# EAGLE design lt3652-pre-v03 (EAGLE 5.10)
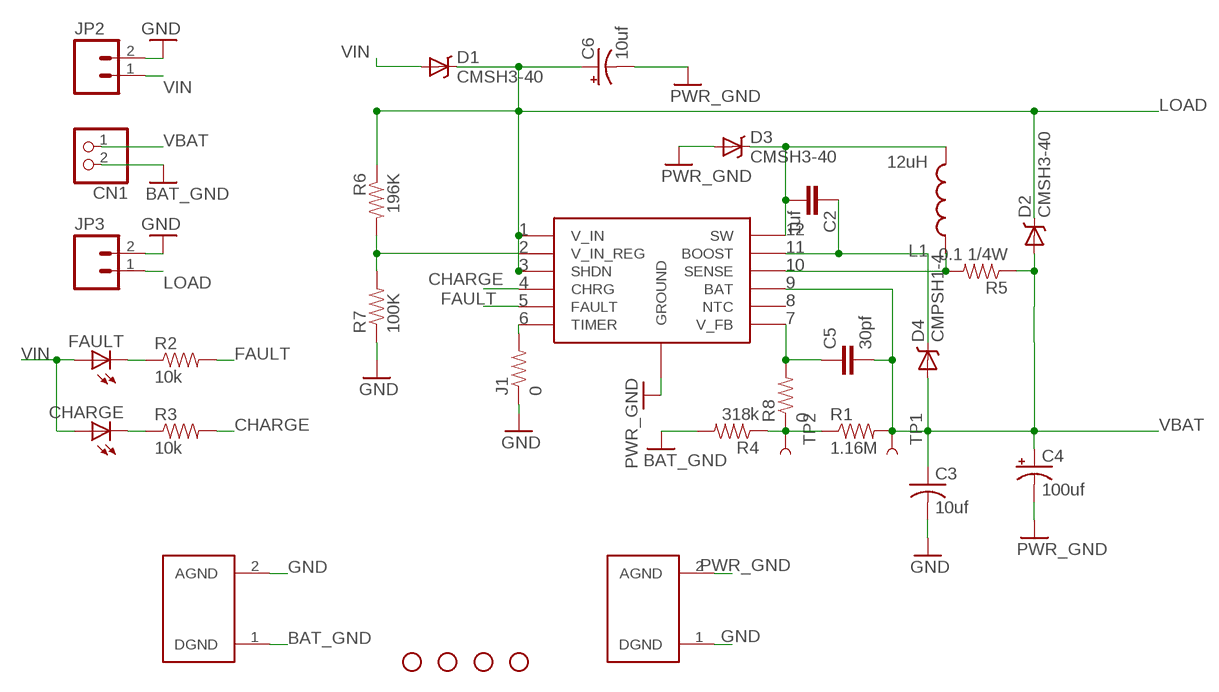
[diagram p0: schematic, sheet 1]

## Parts
C2  1uf  CAP0805  [0805]
C3  10uf  C-USC1210  [C1210]
C4  100uf  CAP_POL7343  [EIA7343]
C5  30pf  CAP0805  [0805]
C6  10uf  CAP_POLE  [PANASONIC_E]
CHARGE  LED0603  [LED-0603]
CN1  JST_2PIN-SMT-RA  [JST-PH-2-SMT-RA]
D1  CMSH3-40  [CMSH3-40]
D2  CMSH3-40  [CMSH3-40]
D3  CMSH3-40  [CMSH3-40]
D4  CMPSH1-4  [CMPSH1-4]
FAULT  LED0603  [LED-0603]
J1  0  RESISTOR  [0805]
JP1  STAND-OFF  [STAND-OFF]
JP2  M023.5MM  [SCREWTERMINAL-3.5MM-2]
JP3  M023.5MM  [SCREWTERMINAL-3.5MM-2]
JP4  STAND-OFF  [STAND-OFF]
JP5  STAND-OFF  [STAND-OFF]
JP6  STAND-OFF  [STAND-OFF]
L1  12uH  PANASONIC_ELLCTV  [PANASONIC_ELLCTV]
R1  1.16M  RESISTOR0603-RES  [0603-RES]
R2  10k  RESISTOR0603-RES  [0603-RES]
R3  10k  RESISTOR0603-RES  [0603-RES]
R4  318k  RESISTOR0603-RES  [0603-RES]
R5  0.1 1/4W  RESISTOR1206  [1206]
R6  196K  RESISTOR0603-RES  [0603-RES]
R7  100K  RESISTOR0603-RES  [0603-RES]
R8  0  RESISTOR0603-RES  [0603-RES]
TP1  TEST-POINT3X5  [PAD.03X.05]
TP2  TEST-POINT3X5  [PAD.03X.05]
U$1  LTC3652_MSOP  [MSOP12]
U$2  AGND_GND  [GND_CONNECT]
U$3  AGND_GND  [GND_CONNECT]

## Nets
BAT_GND: CN1.2 R4.2 U$2.1(DGND)
CHARGE: R3.2 U$1.4(CHRG)
FAULT: R2.2 U$1.5(FAULT)
GND: J1.1 JP2.2 JP3.2 R7.1 U$2.2(AGND) U$3.1(DGND)
LOAD: C6.+ D1.2(C) D2.2(C) JP3.1 R6.1 U$1.1(V_IN) U$1.3(SHDN)
N$1: C5.1 R8.2 U$1.7(V_FB)
N$2: R1.1 R4.1 R8.1 TP2.P$1
N$3: C2.1 D4.3(C) U$1.11(BOOST)
N$4: CHARGE.C R3.1
N$5: FAULT.C R2.1
N$6: L1.1 R5.2 U$1.10(SENSE)
N$13: C2.2 D3.2(C) L1.2 U$1.12(SW)
N$17: J1.2 U$1.6(TIMER)
N$18: R6.2 R7.2 U$1.2(V_IN_REG)
PWR_GND: C3.2 C4.C(-) C6.- D3.1(A) U$1.GND(GROUND) U$3.2(AGND) ; supply symbol labelled GND
VBAT: C3.1 C4.A(+) C5.2 CN1.1 D2.1(A) D4.1(A) R1.2 R5.1 TP1.P$1 U$1.9(BAT)
VIN: CHARGE.A D1.1(A) FAULT.A JP2.1
Unconnected: U$1.8(NTC)

## Library data of the parts
C2 C5 = SparkFun:CAP: Capacitor Standard 0603 ceramic capacitor, and 0.1" leaded capacitor.
C3 = adafruit:C-US: CAPACITOR, American symbol
C4 C6 = SparkFun:CAP_POL: Capacitor Polarized These are standard SMD and PTH capacitors. Normally 10uF, 47uF, and 100uF in electrolytic and tantalum varieties. Always verify the external diameter of the through hole cap, it varies with capacity, voltage, and manufacturer. The EIA devices should be standard.
CHARGE FAULT = SparkFun:LED: LEDs Standard schematic elements and footprints for 5mm, 3mm, 1206, and 0603 sized LEDs. 5mm - Spark Fun Electronics SKU : COM-00529 (and others)
CN1 = adafruit:JST_2PIN: JST 2-Pin Connectors of various flavors SMT-RA (S2B-PH-SM4) 4UConnector #17311 SMT (B2B-PH-SM4) THM-RA (S2B-PH) THM (B2B-PH)
D1-D3 = ssozonoff:CMSH3-40
D4 = ssozonoff:CMPSH1-4
J1 R1-R8 = SparkFun:RESISTOR: Resistor Basic schematic elements and footprints for 0603, 1206, and PTH 1/10th watt (small) resistors.
JP1 JP4-JP6 = SparkFun:STAND-OFF: Stand Off This is the mechanical footprint for a #4 phillips button head screw. Use the keepout ring to avoid running the screw head into surrounding components. SKU : PRT-00447
JP2 JP3 = SparkFun:M02: Header 2 Standard 2-pin 0.1" header. Use with straight break away headers (SKU : PRT-00116), right angle break away headers (PRT-00553), swiss pins (PRT-00743), machine pins (PRT-00117), and female headers (PRT-00115). Molex polarized connector foot print use with SKU : PRT-08233 with associated crimp pins and housings.
L1 = ssozonoff:PANASONIC_ELLCTV
TP1 TP2 = SparkFun:TEST-POINT
U$1 = ssozonoff:LTC3652_MSOP
U$2 U$3 = ssozonoff:AGND_GND

## Board
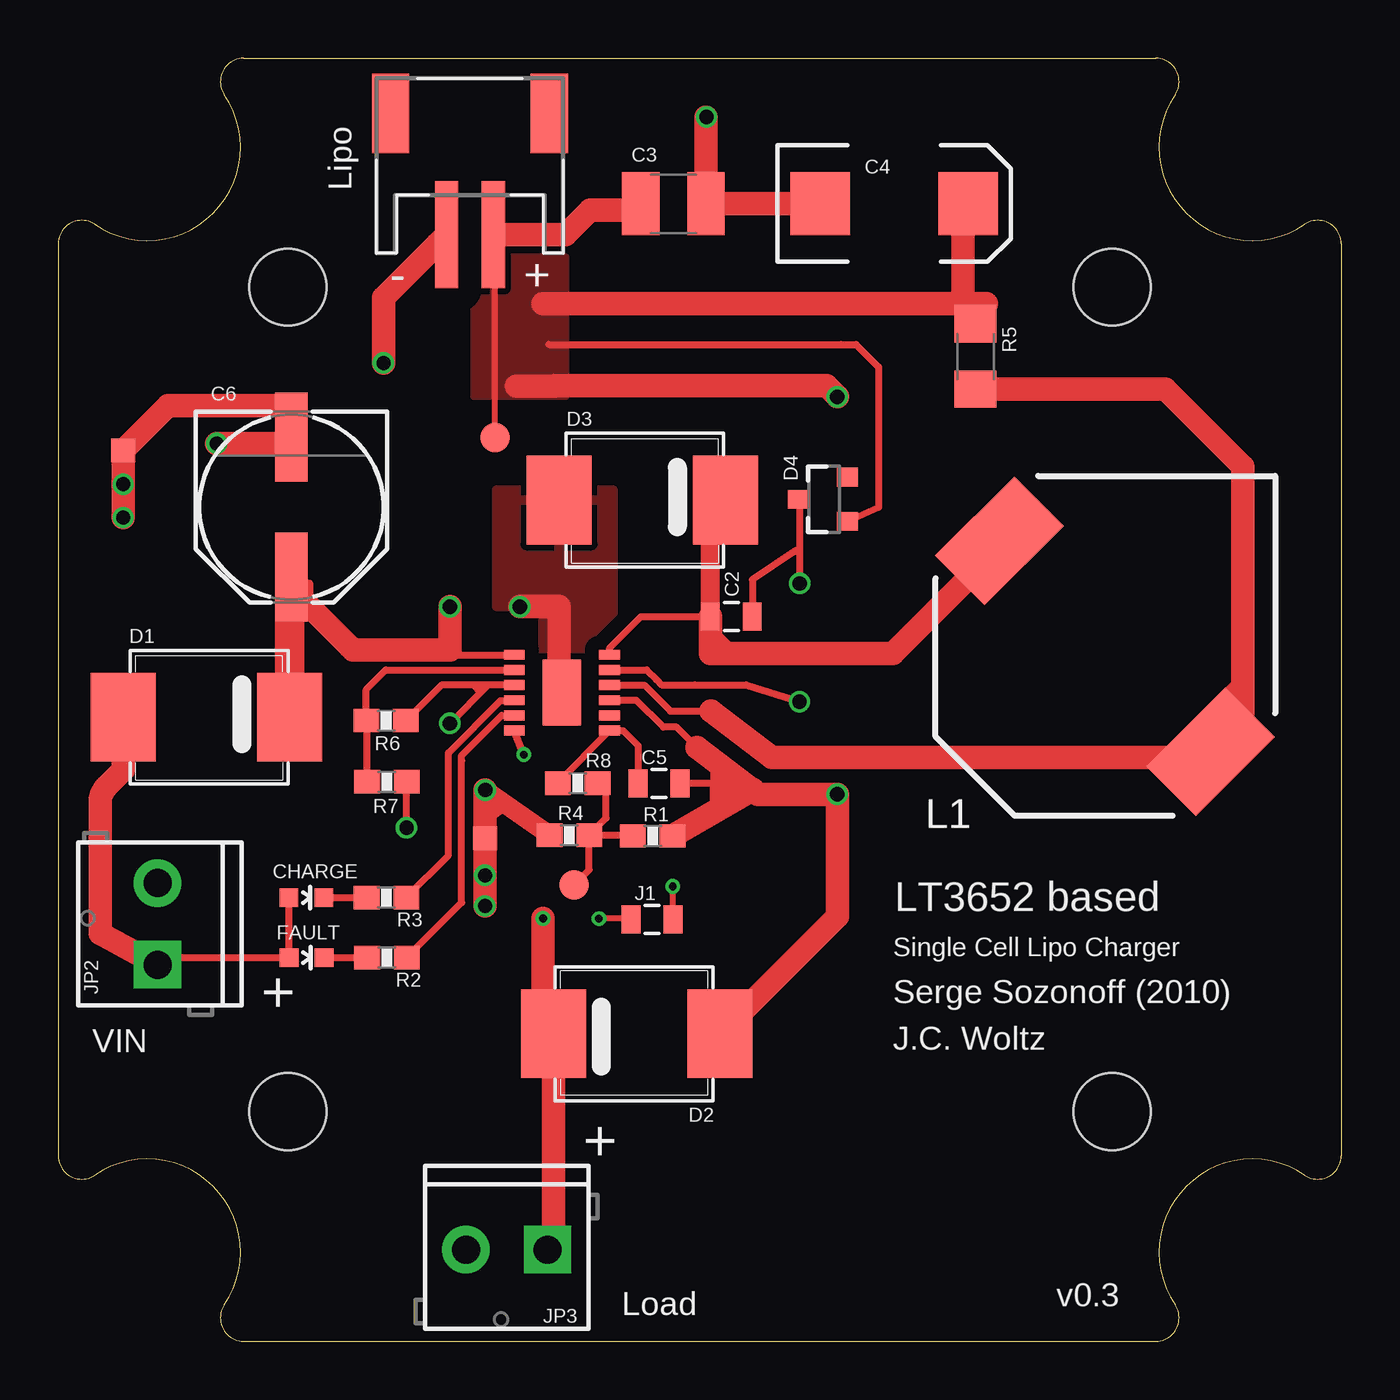
[diagram p1: board, top side]
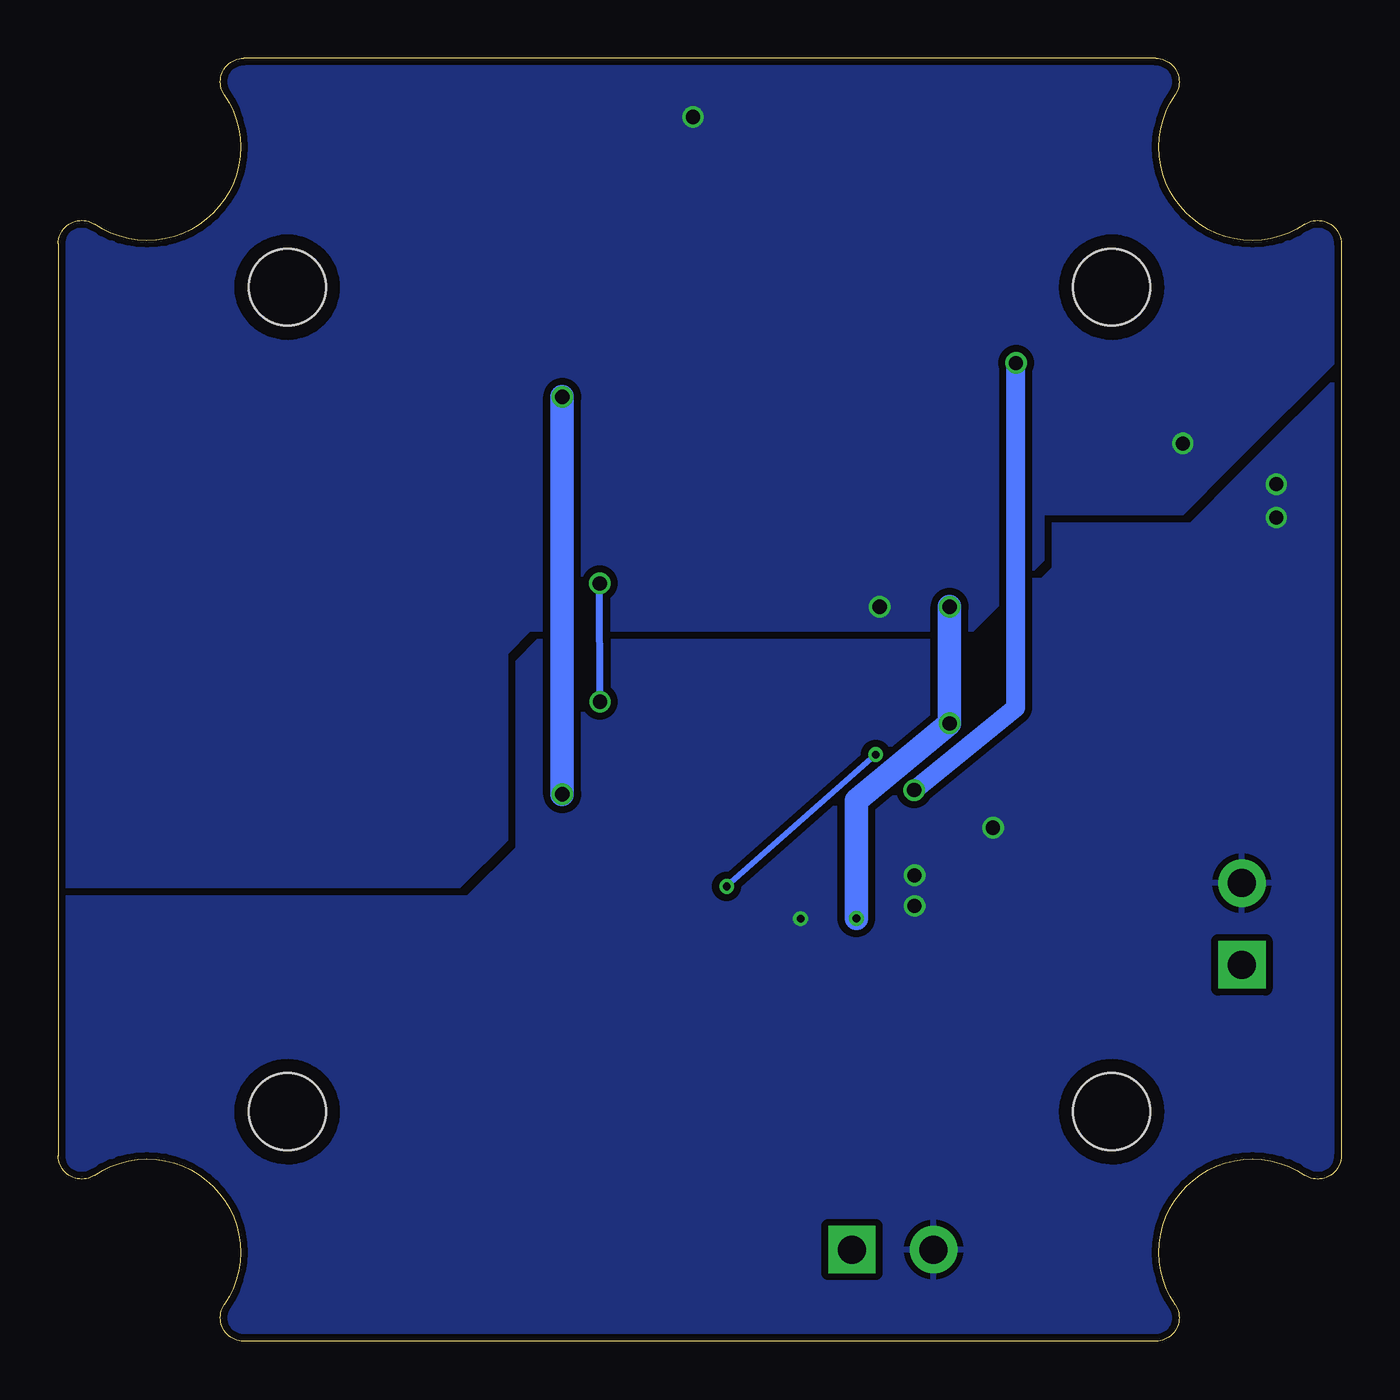
[diagram p2: board, bottom side, seen from below]

Size 55 x 55 mm. Coordinates in mm from the lower left corner, seen from the top.
Outline: 47.88,53.44 arc158 53.44,47.88 arc-124 55,47.05 55,7.95 arc-124 53.44,7.12 arc158 47.88,1.56 arc-124 47.05,0 7.95,0 arc-124 7.12,1.56 arc158 1.56,7.12 arc-124 0,7.95 0,47.05 arc-124 1.56,47.88 arc158 7.12,53.44 arc-124 7.95,55 47.05,55 arc-124 47.88,53.44
Copper layers (1*16): Top 0.035mm / dielectric 1.5mm / Bottom 0.035mm
Design rules "Fusion_eagle_rule_v1.1": minimum track width 6mil, minimum drill 12mil, track to track 6mil, track to pad 6mil, pad to pad 6mil, via to via 6mil, smd to smd 0mil, copper to edge 10mil, drill to drill 10mil, minimum pad ring 10mil, minimum via ring 6mil, stop-mask expansion 2mil, vias tented up to drill 100mil, thermal gap 10mil

### Footprints (pad centres in the part's own frame; a part is rotated, then mirrored left to right if it is on the bottom)
0805 = smd 0.8 x 1.2: 1 -0.9,0; 2 0.9,0
C1210 = smd 1.6 x 2.7: 1 -1.4,0; 2 1.4,0
EIA7343 = smd 2.55 x 2.7: A 3.17,0; C -3.17,0
PANASONIC_E = smd 3.8 x 1.4: + 3,0; - -3,0
LED-0603 = smd 0.8 x 0.8: A 0,-0.75; C 0,0.75
JST-PH-2-SMT-RA = smd 1 x 4.6: 1 1,-3.7; 2 -1,-3.7 | smd 1.6 x 3.4: NC1 -3.4,1.5; NC2 3.4,1.5
CMSH3-40 = smd 2.794 x 3.81: 1 -3.81,-0.127; 2 3.327,-0.127
CMPSH1-4 = smd 0.8 x 0.9: 1 -0.95,-1; 2 0.95,-1; 3 0,1.1
STAND-OFF = hole 3.302: 0,0
SCREWTERMINAL-3.5MM-2 = drill 1.2 pad 2.032 square: 1 0,0 | drill 1.2 pad 2.032 round: 2 3.5,0
PANASONIC_ELLCTV = smd 3 x 4.8 rotated 45: 1 4.248,4.114; 2 -4.802,-4.936
0603-RES = smd 1.1 x 1: 1 -0.85,0; 2 0.85,0
1206 = smd 1.6 x 1.8: 1 -1.4,0; 2 1.4,0
PAD.03X.05 = smd 1.27 x 1.27: P$1 0,0
MSOP12 = smd 0.889 x 0.42: 1 -2.17,1.55; 2 -2.17,0.9; 3 -2.17,0.25; 4 -2.17,-0.4; 5 -2.17,-1.05; 6 -2.17,-1.7; 7 1.92,-1.7; 8 1.92,-1.05; 9 1.92,-0.4; 10 1.92,0.25; 11 1.92,0.9; 12 1.92,1.55 | smd 1.651 x 2.845: GND -0.13,-0.07
GND_CONNECT = smd 1.016 x 1.016: 1 -1.016,0; 2 -1.016,0

### Placement (x,y rotation side)
C2  28.86,31.07 180 top
C3  26.37,48.76 0 top
C4  35.84,48.78 0 top
C5  25.76,23.9 0 top
C6  10,35.76 270 top
CHARGE  10.64,19.02 270 top
CN1  17.65,51.14 0 top
D1  6.6,26.88 0 top
D2  24.56,13.06 180 top
D3  25.28,36.19 0 top
D4  32.84,36.1 90 top
FAULT  10.65,16.45 270 top
J1  25.46,18.08 0 top
JP1  45.19,9.84 0 top
JP2  4.26,16.14 90 top
JP3  20.98,3.93 180 top
JP4  9.84,9.84 0 top
JP5  45.19,45.19 0 top
JP6  9.84,45.19 0 top
L1  45.29,29.52 270 top
R1  25.48,21.66 0 top
R2  14.09,16.45 0 top
R3  14.07,19.02 0 top
R4  21.91,21.7 180 top
R5  39.33,42.22 270 top
R6  14.06,26.61 180 top
R7  14.09,23.99 180 top
R8  22.27,23.93 180 top
TP1  18.73,38.75 0 top
TP2  22.12,19.56 0 top
U$1  21.72,27.88 0 top
U$2  17.28,21.57 180 top
U$3  3.8,38.19 0 top

### Tracks (layer width: path | path; a pad name or v marks a point on that pad's centre or on a via)
BAT_GND  (via drill 0.61)
  Top 0.152: 16.24,47.03 16.64,46.63 | U$2.1 18.29,22.24 18.43,22.38
  Top 0.305: 18.43,22.38 19.21,22.93
  Top 0.813: v18.31,23.63 R4.2
  Top 1.016: CN1.2 16.24,47.03 13.94,44.73 v13.94,41.94 | U$2.1 v18.31,23.63
  Bottom 0.813: v13.94,41.94 13.95,27.17 v18.31,23.63
CHARGE
  Top 0.152: 19.53,27.46 U$1.4
  Top 0.305: R3.2 16.73,20.83 16.73,25.09 16.73,25.23 18.96,27.46 19.53,27.46
FAULT
  Top 0.305: R2.2 17.3,18.81 17.3,24.89 17.3,25.12 19.01,26.83 U$1.5
GND  (via drill 0.33, 0.6, 0.61)
  Top 0.152: R7.1 | v2.78,35.31
  Top 0.254: J1.1 24.52,18.12 v23.18,18.12
  Top 0.305: v14.93,22.02 R7.1
  Top 1.016: v18.29,18.66 U$2.2 | v2.78,35.31 U$3.1
  other vias: 18.29,19.98 2.78,36.74
  pour Bottom (isolate 0.305, rank 2): -1.21,55.49 54.79,55.49 54.79,-0.51 -0.21,-0.51
LOAD  (via drill 0.33, 0.61)
  Top 0.152: 16.79,29.64 16.85,29.43 | 18.43,28.13 U$1.3 | 17.79,28.13 18.07,27.86 | 12.64,29.64 12.49,29.78
  Top 0.254: 10.79,31.49 10.79,32.51 C6.+ | C6.+ 9.92,32.68 | 9.79,32.49 9.79,32.55 C6.+ | D2.2 20.79,13.49
  Top 0.305: R6.1 16.2,27.9 16.43,28.13 17.79,28.13 U$1.3 | 16.85,29.43 U$1.1 | v16.79,26.49 18.43,28.13 | 18.07,27.86 17.89,28.09
  Top 1.016: 12.49,29.78 9.79,32.49 | v16.79,31.49 16.79,29.64 12.64,29.64 | 20.79,13.49 v20.79,18.13 | D2.2 21.23,4.18 JP3.1
  Top 1.27: 9.92,32.68 D1.2
  Bottom 1.016: v16.79,31.49 v16.79,26.49 20.79,23.19 v20.79,18.13
N$1
  Top 0.305: R8.2 22.88,25.42 U$1.7 24.22,26.17 24.86,25.53 C5.1
N$2
  Top 0.152: 23.49,23.56 R8.1 | 24.59,21.7 R1.1
  Top 0.305: 23.49,23.56 23.49,22.42 R4.1 | R4.1 24.59,21.7 | R4.1 22.76,20.21 TP2.P$1
N$3  (via drill 0.61)
  Top 0.152: 31.79,34.49 31.79,34.09 31.54,33.85
  Top 0.254: 31.79,36.05 D4.3
  Top 0.305: v31.78,27.42 29.5,28.14 27.29,28.14 25.87,28.14 25.65,28.36 25.23,28.78 U$1.11 | v31.79,32.49 31.79,34.49 31.79,36.05 | C2.1 29.76,32.65 31.54,33.85 31.65,33.92
  Bottom 0.305: v31.78,27.42 v31.79,32.49
N$4
  Top 0.305: CHARGE.C R3.1
N$5
  Top 0.305: FAULT.C R2.1
N$6
  Top 0.152: U$1.10 24,28.13 | 50.62,26.49 50.79,26.49 | L1.1 50.62,26.49 | 50.62,26.49 49.79,27.49
  Top 0.254: 49.79,24.49 49.79,24.88 L1.1 49.15,25.02 | 30.6,25.02 30.79,25.02
  Top 0.305: U$1.10 25.13,28.13 26.24,27.02 27.99,27.02
  Top 0.406: 49.79,27.49 50.58,28.28
  Top 1.016: 30.79,25.02 36.79,25.02 49.15,25.02 | 27.99,27.02 30.6,25.02 | R5.2 47.46,40.82 50.79,37.49 50.79,26.49
N$13
  Top 0.152: C2.2 28.28,31.07 28.28,30.71 | 28.76,29.79 28.76,29.49 28.79,29.49
  Top 0.254: 27.96,35.89 28.15,36.08 28.15,36.73 D3.2
  Top 0.305: C2.2 24.98,31.07 23.64,29.72 U$1.12
  Top 0.406: 28.76,29.79 28.24,30.3
  Top 0.813: C2.2 27.96,35.89
  Top 1.016: L1.2 40.35,34.05 35.79,29.49 28.79,29.49 27.96,29.49 C2.2
N$17  (via drill 0.33)
  Top 0.254: J1.2 v26.35,19.49
  Top 0.305: v19.96,25.15 U$1.6
  Bottom 0.254: v26.35,19.49 v19.96,25.15
N$18
  Top 0.152: U$1.2 19.41,28.64
  Top 0.254: 13.24,26.58 R6.2
  Top 0.305: R6.2 13.21,27.95 14.04,28.78 U$1.2 | R7.2 13.24,26.58
PWR_GND  (via drill 0.61)
  Top 0.152: C3.2 27.77,48.78 | 9.98,40.11 C6.-
  Top 0.254: C6.- 9.79,38.49 | 27.77,52.47 v27.79,52.49 | C3.2 27.79,48.78 | U$1.GND 21.47,27.83
  Top 1.016: 9.79,38.49 v6.79,38.49 | C3.2 27.77,52.47 | 27.77,48.78 C4.C | 21.47,27.83 21.47,31.49 v19.79,31.49 | 9.98,40.11 4.7,40.11 U$3.2
  pour Top (isolate 0.61): 20.79,36.49 18.79,36.49 18.79,31.49 20.79,31.49 20.79,28.49 21.79,28.49 23.79,28.49 23.79,36.49
  pour Bottom (isolate 0.305): -0.21,55.49 -0.21,42.49 4.79,37.49 6.79,35.49 12.79,35.49 12.79,33.49 15.79,30.49 34.79,30.49 35.79,29.49 35.79,21.49 37.79,19.49 55.79,19.49 55.79,55.49
VBAT  (via drill 0.61)
  Top 0.152: 29.91,23.53 29.9,23.52 | C3.1 24.79,48.76 24.79,48.49 | 27.38,25.46 28.02,25.46 28.02,24.62 28.24,24.62 28.45,24.41 | 30.79,23.49 30.45,23.83 | 29.99,23.45 29.53,23.9
  Top 0.254: CN1.1 18.65,46.63 | 39.79,44.49 38.79,44.16 R5.1 | 30.79,23.49 30.83,23.45 30.79,23.45 | 29.99,23.45 29.91,23.53 29.78,23.66 | 38.79,47.49 38.79,48.56 C4.A | U$1.9 23.38,27.45 | 21.31,40.96 21.29,40.94 | TP1.P$1 18.73,45.43 18.79,45.49
  Top 0.305: 21.04,42.73 33.56,42.73 34.2,42.73 35.17,41.76 35.17,35.75 D4.1 33.87,35.18 | 27.38,25.46 26.51,26.33 25.94,26.33 24.79,27.48 U$1.9 | 29.53,23.9 C5.2
  Top 1.016: 20.79,44.49 38.79,44.49 | 38.79,44.49 38.79,47.49 | 38.79,44.49 39.79,44.49 | 30.83,23.45 v33.4,23.45 33.4,18.21 D2.1 | 21.31,40.96 32.1,40.96 32.93,40.96 v33.4,40.49 | 29.78,23.66 R1.2 | 30.79,23.45 29.99,23.45 | CN1.1 21.74,47.44 22.79,48.49 24.7,48.49 C3.1 | 29.91,23.53 27.38,25.46 | 21.29,40.94 19.66,40.94 | 28.45,24.41 28.44,23.19
  Bottom 1.016: v33.4,23.45 v33.4,40.49
  pour Top (isolate 1.016): 17.79,46.49 17.79,40.49 21.79,40.49 21.79,46.49
VIN
  Top 0.254: CHARGE.A | JP2.1 4.57,16.45
  Top 0.305: CHARGE.A FAULT.A 4.57,16.45
  Top 1.016: D1.1 2.79,24.49 2.08,23.78 arc45 1.79,23.07 1.79,17.49 JP2.1

### Text on the board
tPlace: Lipo | LT3652 based | Single Cell Lipo Charger | + | Serge Sozonoff (2010) | VIN | J.C. Woltz | + | Load | v0.3